# EAGLE schematic Shift_Register_IO_Breakout (EAGLE 9.6.2)
AUTHOR: Adam Billingsley; VERSION: v1.0
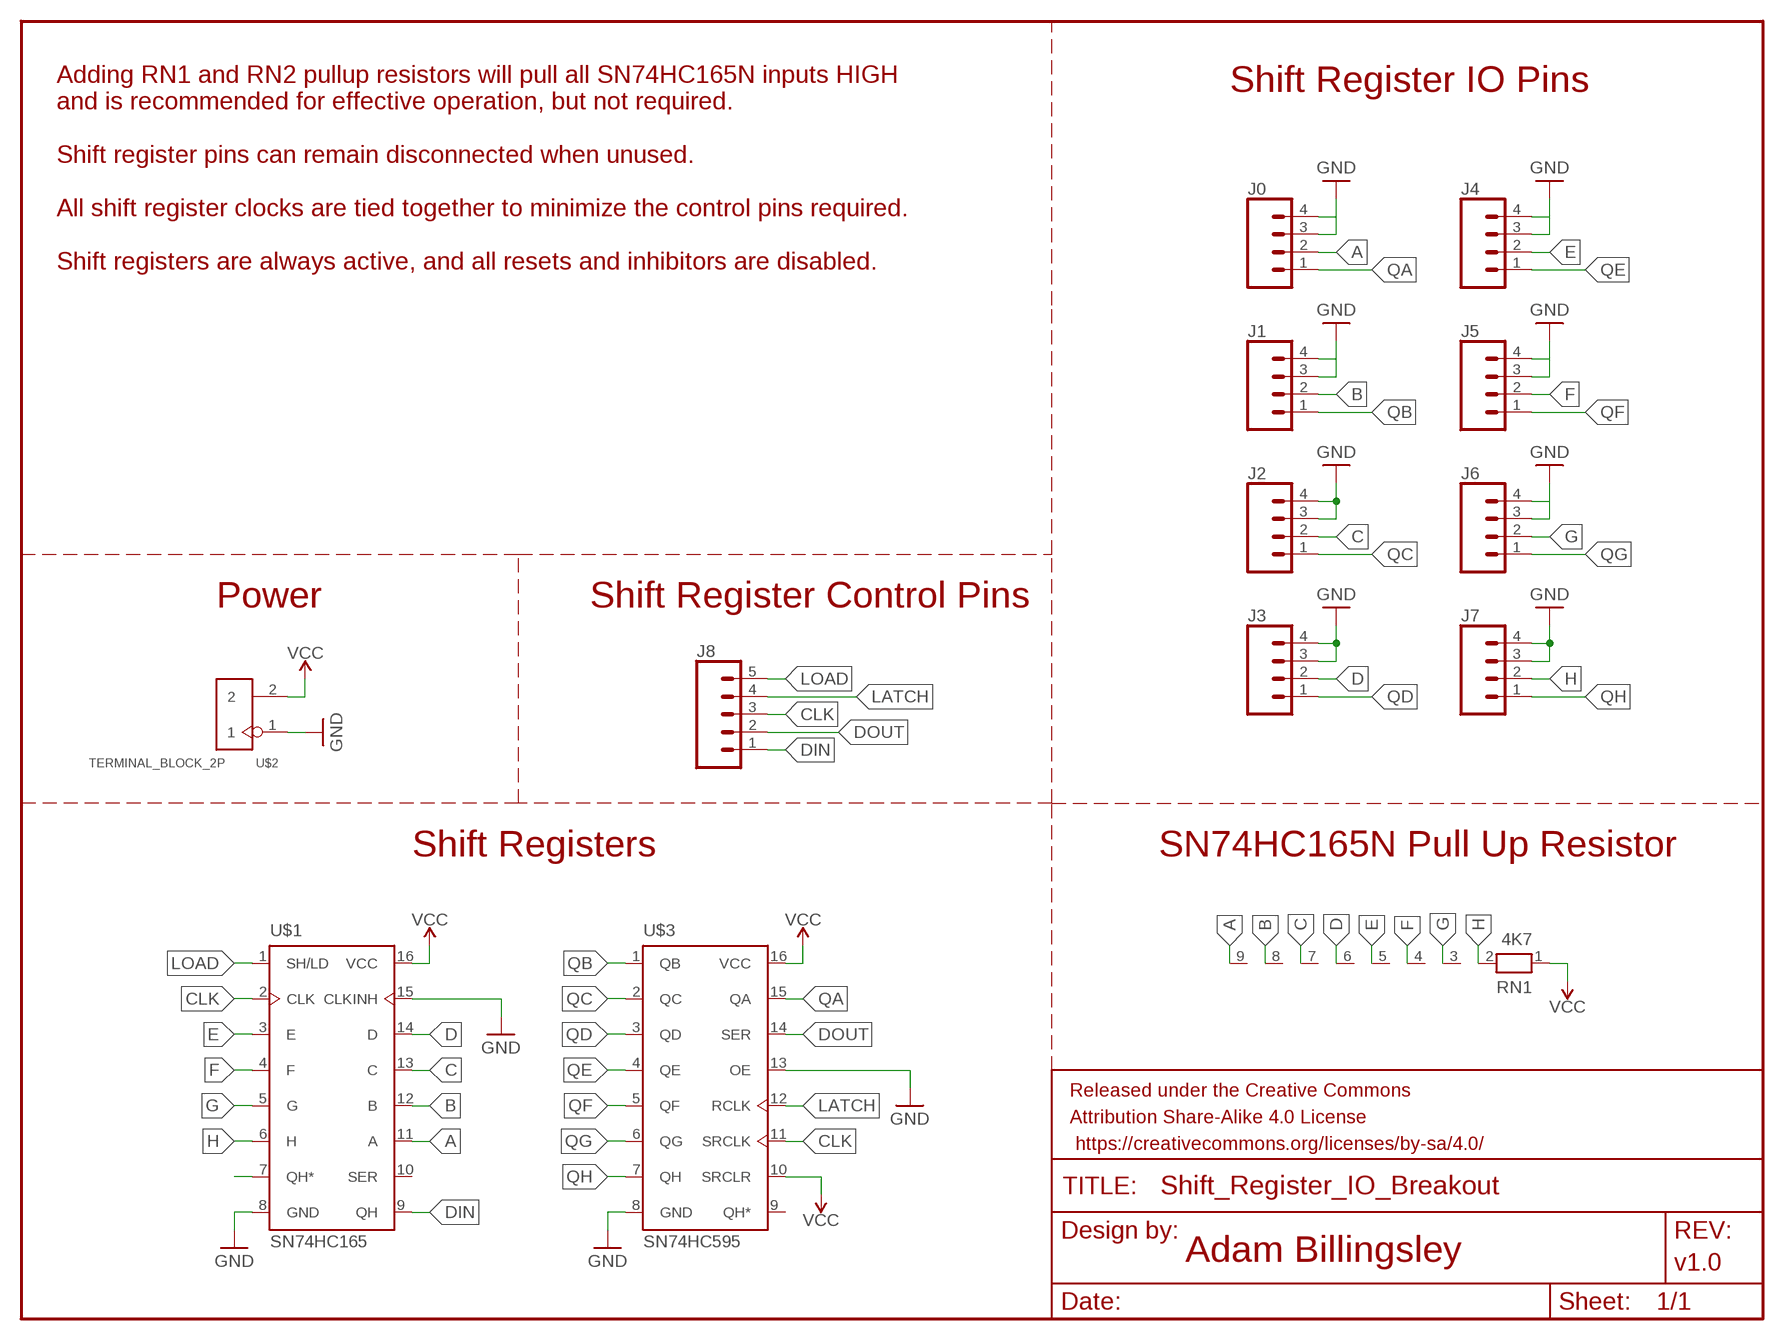
[diagram p0: schematic, sheet 1]

## Parts
FRAME1  FRAME-LETTER  [CREATIVE_COMMONS]
J0  CONN_04  [1X04]
J1  CONN_04  [1X04]
J2  CONN_04  [1X04]
J3  CONN_04  [1X04]
J4  CONN_04  [1X04]
J5  CONN_04  [1X04]
J6  CONN_04  [1X04]
J7  CONN_04  [1X04]
J8  CONN_05  [1X05]
RN1  4K7  RN08  [RN-9]
U$1  SN74HC165  [DIL16]
U$2  TERMINAL_BLOCK_2P  [H2-5.0-10.5X8.0MM]
U$3  SN74HC595  [DIL16]

## Nets
A: J0.2 RN1.9 U$1.11(A)
B: J1.2 RN1.8 U$1.12(B)
C: J2.2 RN1.7 U$1.13(C)
CLK: J8.3 U$1.2(CLK) U$3.11(SRCLK)
D: J3.2 RN1.6 U$1.14(D)
DIN: J8.1 U$1.9(QH)
DOUT: J8.2 U$3.14(SER)
E: J4.2 RN1.5 U$1.3(E)
F: J5.2 RN1.4 U$1.4(F)
G: J6.2 RN1.3 U$1.5(G)
GND: J0.3 J0.4 J1.3 J1.4 J2.3 J2.4 J3.3 J3.4 J4.3 J4.4 J5.3 J5.4 J6.3 J6.4 J7.3 J7.4 U$1.8(GND) U$1.15(CLKINH) U$2.1 U$3.8(GND) U$3.13(OE)
H: J7.2 RN1.2 U$1.6(H)
LATCH: J8.4 U$3.12(RCLK)
LOAD: J8.5 U$1.1(SH/LD)
N$5: U$1.7(QH*)
QA: J0.1 U$3.15(QA)
QB: J1.1 U$3.1(QB)
QC: J2.1 U$3.2(QC)
QD: J3.1 U$3.3(QD)
QE: J4.1 U$3.4(QE)
QF: J5.1 U$3.5(QF)
QG: J6.1 U$3.6(QG)
QH: J7.1 U$3.7(QH)
VCC: RN1.1 U$1.16(VCC) U$2.2 U$3.10(SRCLR) U$3.16(VCC)
Unconnected: U$1.10(SER) U$3.9(QH*)

## Notes on the sheet
- Shift Register IO Pins
- Adding RN1 and RN2 pullup resistors will pull all SN74HC165N inputs HIGH 
  and is recommended for effective operation, but not required.
- Shift register pins can remain disconnected when unused.
- All shift register clocks are tied together to minimize the control pins required.
- Shift registers are always active, and all resets and inhibitors are disabled.
- Power | Shift Register Control Pins
- Shift Registers | SN74HC165N Pull Up Resistor

## Library data of the parts
FRAME1 = Adam's Parts (work):FRAME-LETTER: Schematic Frame - Letter Standard 8.5x11 US Letter frame
J0 J1-J7 = SparkFun-Connectors:CONN_04: Multi connection point. Often used as Generic Header-pin footprint for 0.1 inch spaced/style header connections On any of the 0.1 inch spaced packages, you can populate with these: Break Away Headers - Straight <https://www.sparkfun.com/products/116> (PRT-00116) Break Away Male Headers - Right Angle <https://www.sparkfun.com/products/553> (PRT-00553) Female Headers <https://www.sparkfun.com/products/115> (PRT-00115) Break Away Headers - Machine Pin <https://www.sparkfun.com/products/117> (PRT-00117) Break Away Female Headers - Swiss Machine Pin <https://www.sparkfun.com/products/743> (PRT-00743) For SCREWTERMINALS and SPRING TERMINALS visit here: Screw Terimnals on SparkFun.com <https://www.sparkfun.com/search/results?term=Screw+Terminals> (5mm/3.5mm/2.54mm spacing) This device is also useful as a general connection point to wire up your design to another part of your project. Our various solder wires solder well into these plated through hole pads. Hook-Up Wire - Assortment (Stranded, 22 AWG) <https://www.sparkfun.com/products/11375> (PRT-11375) Hook-Up Wire - Assortment (Solid Core, 22 AWG) <https://www.sparkfun.com/products/11367> (PRT-11367) View the entire wire category on our website here <https://www.sparkfun.com/categories/141> Special notes: Molex polarized connector foot print use with SKU : PRT-08231 with associated crimp pins and housings. 1MM SMD Version SKU: PRT-10208; PROD_ID: CONN-09696
J8 = SparkFun-Connectors:CONN_05: Multi connection point. Often used as Generic Header-pin footprint for 0.1 inch spaced/style header connections On any of the 0.1 inch spaced packages, you can populate with these: Break Away Headers - Straight <https://www.sparkfun.com/products/116> (PRT-00116) Break Away Male Headers - Right Angle <https://www.sparkfun.com/products/553> (PRT-00553) Female Headers <https://www.sparkfun.com/products/115> (PRT-00115) Break Away Headers - Machine Pin <https://www.sparkfun.com/products/117> (PRT-00117) Break Away Female Headers - Swiss Machine Pin <https://www.sparkfun.com/products/743> (PRT-00743) For SCREWTERMINALS and SPRING TERMINALS visit here: Screw Terimnals on SparkFun.com <https://www.sparkfun.com/search/results?term=Screw+Terminals> (5mm/3.5mm/2.54mm spacing) This device is also useful as a general connection point to wire up your design to another part of your project. Our various solder wires solder well into these plated through hole pads. Hook-Up Wire - Assortment (Stranded, 22 AWG) <https://www.sparkfun.com/products/11375> (PRT-11375) Hook-Up Wire - Assortment (Solid Core, 22 AWG) <https://www.sparkfun.com/products/11367> (PRT-11367) View the entire wire category on our website here <https://www.sparkfun.com/categories/141> Special notes: Molex polarized connector foot print use with SKU : PRT-08231 with associated crimp pins and housings. 1MM SMD Version SKU: PRT-10208
RN1 = resistor-net:RN08: RESISTOR NETWORK; OC_FARNELL: unknown; OC_NEWARK: unknown
U$1 = Adam's Parts (work):SN74HC165
U$2 = Adam's Parts (work):TERMINAL_BLOCK_2P
U$3 = Adam's Parts (work):SN74HC595